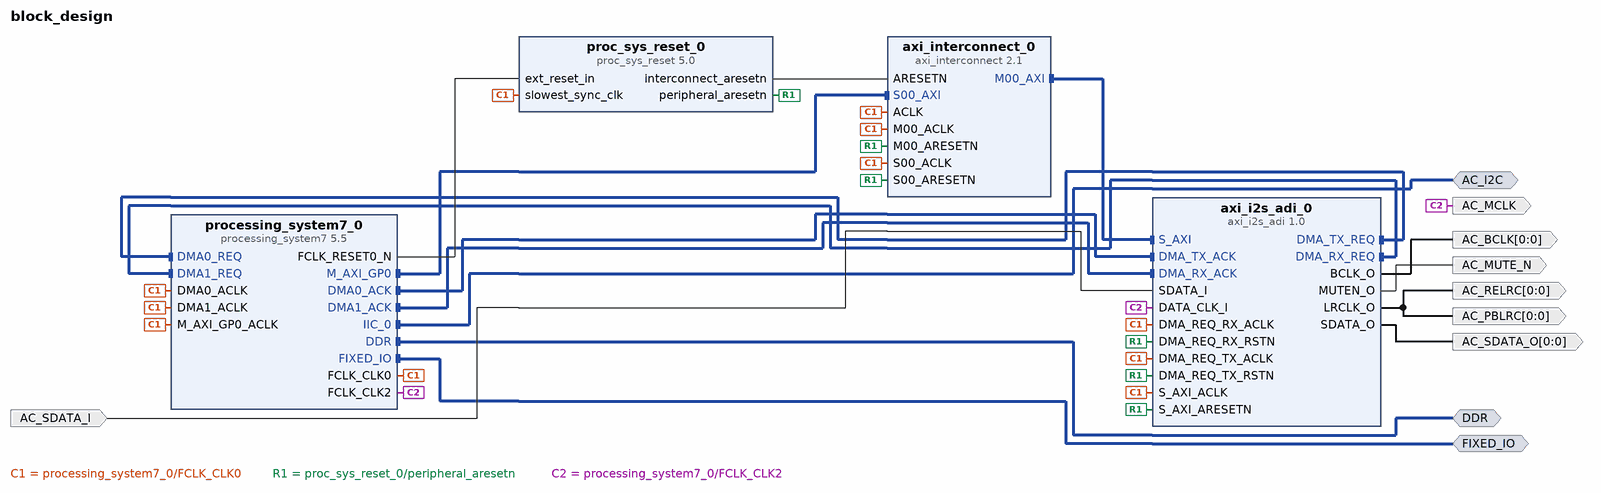
[diagram p0: block diagram of the top level]
# Vivado block design block_design, Vivado 2016.2
create_bd_design block_design

create_bd_intf_port -mode Master -vlnv xilinx.com:interface:ddrx_rtl:1.0 DDR
create_bd_intf_port -mode Master -vlnv xilinx.com:display_processing_system7:fixedio_rtl:1.0 FIXED_IO
create_bd_intf_port -mode Master -vlnv xilinx.com:interface:iic_rtl:1.0 AC_I2C
create_bd_port -dir O -type clk AC_MCLK
create_bd_port -dir I AC_SDATA_I
create_bd_port -dir O AC_MUTE_N
create_bd_port -dir O -from 0 -to 0 AC_SDATA_O
create_bd_port -dir O -from 0 -to 0 AC_BCLK
create_bd_port -dir O -from 0 -to 0 AC_RELRC
create_bd_port -dir O -from 0 -to 0 AC_PBLRC

create_bd_cell -type ip -vlnv xilinx.com:ip:processing_system7:5.5 processing_system7_0
set_property -dict [list \
  CONFIG.PCW_USE_DMA0 1 \
  CONFIG.PCW_USE_DMA1 1 \
  CONFIG.PCW_EN_CLK2_PORT 1 \
  CONFIG.PCW_IMPORT_BOARD_PRESET /opt/Xilinx/Projects/zybo_base_system/source/vivado/hw/lib/xml/ZYBO_zynq_def.xml \
  CONFIG.PCW_QSPI_GRP_SINGLE_SS_ENABLE 1 \
  CONFIG.PCW_SD0_PERIPHERAL_ENABLE 0 \
  CONFIG.PCW_TTC0_PERIPHERAL_ENABLE 1 \
  CONFIG.PCW_TTC0_TTC0_IO {MIO 30 .. 31} \
  CONFIG.PCW_USB0_PERIPHERAL_ENABLE 0 \
  CONFIG.PCW_I2C0_PERIPHERAL_ENABLE 1 \
] [get_bd_cells processing_system7_0]
# 4 more settings of processing_system7_0 are not shown: defaults, MIO pin electricals, DDR timing, and values the tool derives
create_bd_cell -type ip -vlnv analogdeviceinc.com:adi:axi_i2s_adi:1.0 axi_i2s_adi_0
set_property -dict {CONFIG.C_DMA_TYPE 1} [get_bd_cells axi_i2s_adi_0]
create_bd_cell -type ip -vlnv xilinx.com:ip:proc_sys_reset:5.0 proc_sys_reset_0
create_bd_cell -type ip -vlnv xilinx.com:ip:axi_interconnect:2.1 axi_interconnect_0
set_property -dict [list \
  CONFIG.NUM_MI 1 \
  CONFIG.STRATEGY 0 \
  CONFIG.M00_HAS_REGSLICE 4 \
  CONFIG.M01_HAS_REGSLICE 4 \
] [get_bd_cells axi_interconnect_0]

# ---- connections ----

connect_bd_intf_net [get_bd_intf_pins axi_interconnect_0/M00_AXI] [get_bd_intf_pins axi_i2s_adi_0/S_AXI]
connect_bd_intf_net [get_bd_intf_pins axi_i2s_adi_0/DMA_TX_REQ] [get_bd_intf_pins processing_system7_0/DMA0_REQ]
connect_bd_intf_net [get_bd_intf_pins axi_i2s_adi_0/DMA_RX_REQ] [get_bd_intf_pins processing_system7_0/DMA1_REQ]
connect_bd_intf_net [get_bd_intf_pins processing_system7_0/DMA0_ACK] [get_bd_intf_pins axi_i2s_adi_0/DMA_TX_ACK]
connect_bd_intf_net [get_bd_intf_pins processing_system7_0/DMA1_ACK] [get_bd_intf_pins axi_i2s_adi_0/DMA_RX_ACK]
connect_bd_intf_net [get_bd_intf_pins processing_system7_0/M_AXI_GP0] [get_bd_intf_pins axi_interconnect_0/S00_AXI]
connect_bd_intf_net [get_bd_intf_ports DDR] [get_bd_intf_pins processing_system7_0/DDR]
connect_bd_intf_net [get_bd_intf_ports FIXED_IO] [get_bd_intf_pins processing_system7_0/FIXED_IO]
connect_bd_intf_net [get_bd_intf_ports AC_I2C] [get_bd_intf_pins processing_system7_0/IIC_0]
connect_bd_net [get_bd_pins processing_system7_0/FCLK_CLK0] \
  [get_bd_pins processing_system7_0/M_AXI_GP0_ACLK] [get_bd_pins processing_system7_0/DMA0_ACLK] \
  [get_bd_pins processing_system7_0/DMA1_ACLK] [get_bd_pins proc_sys_reset_0/slowest_sync_clk] \
  [get_bd_pins axi_i2s_adi_0/S_AXI_ACLK] [get_bd_pins axi_i2s_adi_0/DMA_REQ_TX_ACLK] \
  [get_bd_pins axi_i2s_adi_0/DMA_REQ_RX_ACLK] [get_bd_pins axi_interconnect_0/ACLK] [get_bd_pins axi_interconnect_0/S00_ACLK] \
  [get_bd_pins axi_interconnect_0/M00_ACLK]
connect_bd_net [get_bd_pins processing_system7_0/FCLK_RESET0_N] [get_bd_pins proc_sys_reset_0/ext_reset_in]
connect_bd_net [get_bd_pins proc_sys_reset_0/interconnect_aresetn] [get_bd_pins axi_interconnect_0/ARESETN]
connect_bd_net [get_bd_pins proc_sys_reset_0/peripheral_aresetn] \
  [get_bd_pins axi_i2s_adi_0/S_AXI_ARESETN] [get_bd_pins axi_i2s_adi_0/DMA_REQ_TX_RSTN] \
  [get_bd_pins axi_i2s_adi_0/DMA_REQ_RX_RSTN] [get_bd_pins axi_interconnect_0/S00_ARESETN] \
  [get_bd_pins axi_interconnect_0/M00_ARESETN]
connect_bd_net [get_bd_pins processing_system7_0/FCLK_CLK2] [get_bd_ports AC_MCLK] [get_bd_pins axi_i2s_adi_0/DATA_CLK_I]
connect_bd_net [get_bd_ports AC_SDATA_I] [get_bd_pins axi_i2s_adi_0/SDATA_I]
connect_bd_net [get_bd_pins axi_i2s_adi_0/MUTEN_O] [get_bd_ports AC_MUTE_N]
connect_bd_net [get_bd_pins axi_i2s_adi_0/SDATA_O] [get_bd_ports AC_SDATA_O]
connect_bd_net [get_bd_pins axi_i2s_adi_0/BCLK_O] [get_bd_ports AC_BCLK]
connect_bd_net [get_bd_pins axi_i2s_adi_0/LRCLK_O] [get_bd_ports AC_PBLRC] [get_bd_ports AC_RELRC]

# ---- address map ----
assign_bd_address -offset 0x43C00000 -range 64K -target_address_space [get_bd_addr_spaces processing_system7_0/Data] [get_bd_addr_segs axi_i2s_adi_0/S_AXI/S_AXI_reg]

validate_bd_design
save_bd_design
